# Altium schematic sheet 001-0001_Christmas_Ornament_Battery_Charging.SchDoc: Battery Charging
size A3; ApprovedBy: [FILL-HERE]; Author: HILT; Organization: [FILL-HERE]; Address1: [FILL-HERE]; Address2: [FILL-HERE]; Address3: [FILL-HERE]; Address4: [FILL-HERE]; SheetNumber: 2; SheetTotal: 2; ProjectTitle: Christmas Ornament
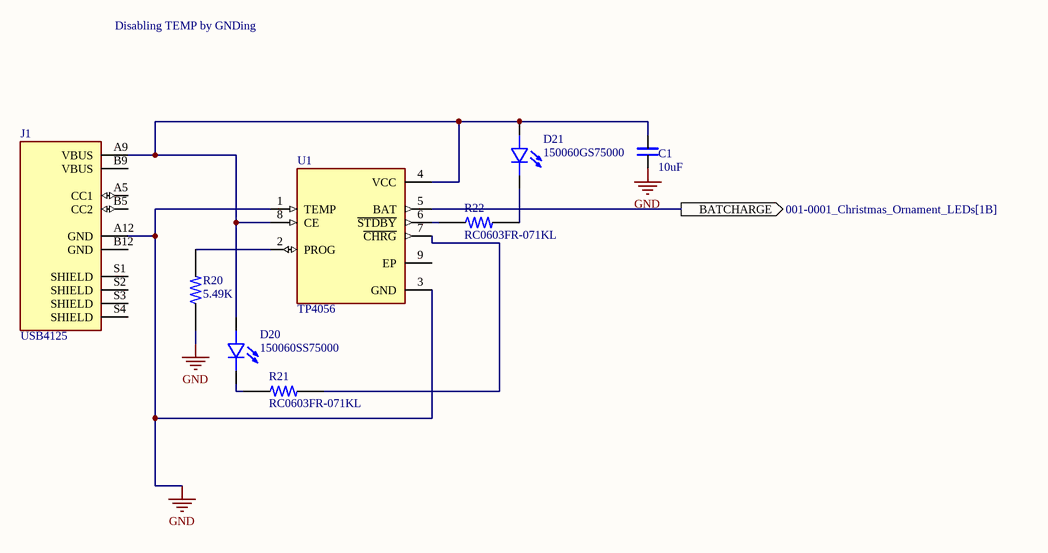
[diagram p0: 001-0001_Christmas_Ornament_Battery_Charging.SchDoc]

## Parts
C1  10uF  [EMK107BC6106MA-T]
D20  150060SS75000  [LED_150060SS75000]
D21  150060GS75000  [LEDC1608X80N]
J1  USB4125  [USB4125-GF-A-0190]
R20  5.49K  [ERJ-PA3F51R0V]
R21  RC0603FR-071KL  [RESC1607X60N]
R22  RC0603FR-071KL  [RESC1607X60N]
U1  TP4056  [TP4056]

## Ports
BATCHARGE (out, see 001-0001_Christmas_Ornament_LEDs[1B])

## Nets
GND: C1.1 J1.A12(GND) R20.1 U1.1(TEMP) U1.3(GND)
BATCHARGE: U1.5(BAT) ; port BATCHARGE
NetC1_2: C1.2 D20.A D21.A J1.A9(VBUS) U1.4(VCC) U1.8(CE)
NetD20_C: D20.C R21.1
NetD21_C: D21.C R22.2
NetR20_2: R20.2 U1.2(PROG)
NetR21_2: R21.2 U1.7(~{CHRG})
NetR22_1: R22.1 U1.6(~{STDBY})

Not connected (* = marked no-connect by the designer): J1 A5(CC1) B5(CC2) B9(VBUS) B12(GND) S1(SHIELD) S2(SHIELD) S3(SHIELD) S4(SHIELD); U1 9(EP)

## Notes on the sheet
- Disabling TEMP by GNDing
- Title:
- Author:
- Approved:
- Size:
- Date:
- Git Hash:
- A3
- Prj:
- SW Version:
- Variant:
- Edited:
- File:

## Library data of the parts
C1 = EMK107BC6106MA-T: CAP CER 10UF 16V X6S 0603; Package: None; Price: None; Value: *; MP: EMK107BC6106MA-T; Availability: Unavailable
D20 = 150060SS75000: Red 630nm LED Indication - Discrete 1.9V 0603 (1608 Metric)  <a href="https://pricing.snapeda.com/parts/150060SS75000/W%C3%BCrth%20Elektronik/view-part?ref=eda">Check availability</a>; MF: {'manufacturer': u'Wurth Electronics'}; Package: None; Price: None; Value: *; MP: 150060SS75000; Availability: Unavailable; Supplier 1: Digikey; Supplier Part Number 1: 732-4979-1-ND
D21 = 150060GS75000: Green 520nm LED Indication - Discrete 3.2V 0603 (1608 Metric); MF: Wurth Electronics; SnapEDA_Link: https://www.snapeda.com/parts/150060GS75000/Wurth%20Electronics%20Inc./view-part/548131/?ref=snap; Availability: Warning; Price: None; Value: *; DigiKey-Purchase-URL: https://snapeda.com/shop?store=DigiKey&id=548131; Mouser-Purchase-URL: https://snapeda.com/shop?store=Mouser&id=548131; MP: 150060GS75000; Package: 0603 WÃ¼rth Elektronik; Supplier 1: Digikey; Supplier Part Number 1: 732-4971-1-ND
J1 = USB4125-GF-A-0190: Type C Receptacle, Horizontal, SMT, For Power Charging Only; MF: Global Connector Technology; Price: None; Check_prices: https://www.snapeda.com/parts/USB4125-GF-A-0190/Global%20Connector%20Technology/view-part/6227012/?ref=eda; Package: None; Value: *; MP: USB4125-GF-A-0190; SnapEDA_Link: https://www.snapeda.com/parts/USB4125-GF-A-0190/Global%20Connector%20Technology/view-part/6227012/?ref=snap; Availability: No availability data
R20 = ERJ-3EKF5491V: RES SMD 5.49K OHM 1% 1/10W 0603; MP: ERJPA3F51R0V; Price: None; Value: *; Availability: Unavailable; Package: None; Supplier 1: Mouser; Supplier Part Number 1: 667-ERJ-3EKF5491V
R21 R22 = RC0603FR-071KL: 1 kOhms Â±1% 0.1W, 1/10W Chip Resistor 0603 (1608 Metric) Moisture Resistant Thick Film; MF: Yageo; SnapEDA_Link: https://www.snapeda.com/parts/RC0603FR-071KL/Yageo/view-part/?ref=snap; Package: 0603 Yageo; Value: *; MP: RC0603FR-071KL; Check_prices: https://www.snapeda.com/parts/RC0603FR-071KL/Yageo/view-part/?ref=eda; Supplier 1: Digikey; Supplier Part Number 1: 311-1.00KHRCT-ND
U1 = TP4056: Complete single cell Li-Ion battery with a constant current / constant voltage linear charger; MF: NanJing Top Power ASIC Corp.; Check_prices: https://www.snapeda.com/parts/TP4056/NanJing+Top+Power+ASIC+Corp./view-part/?ref=eda; SnapEDA_Link: https://www.snapeda.com/parts/TP4056/NanJing+Top+Power+ASIC+Corp./view-part/?ref=snap; Price: None; Availability: Not in stock; Package: Package; MP: TP4056; Value: *